# Altium project bs.PrjPcb (part 3 of 3)
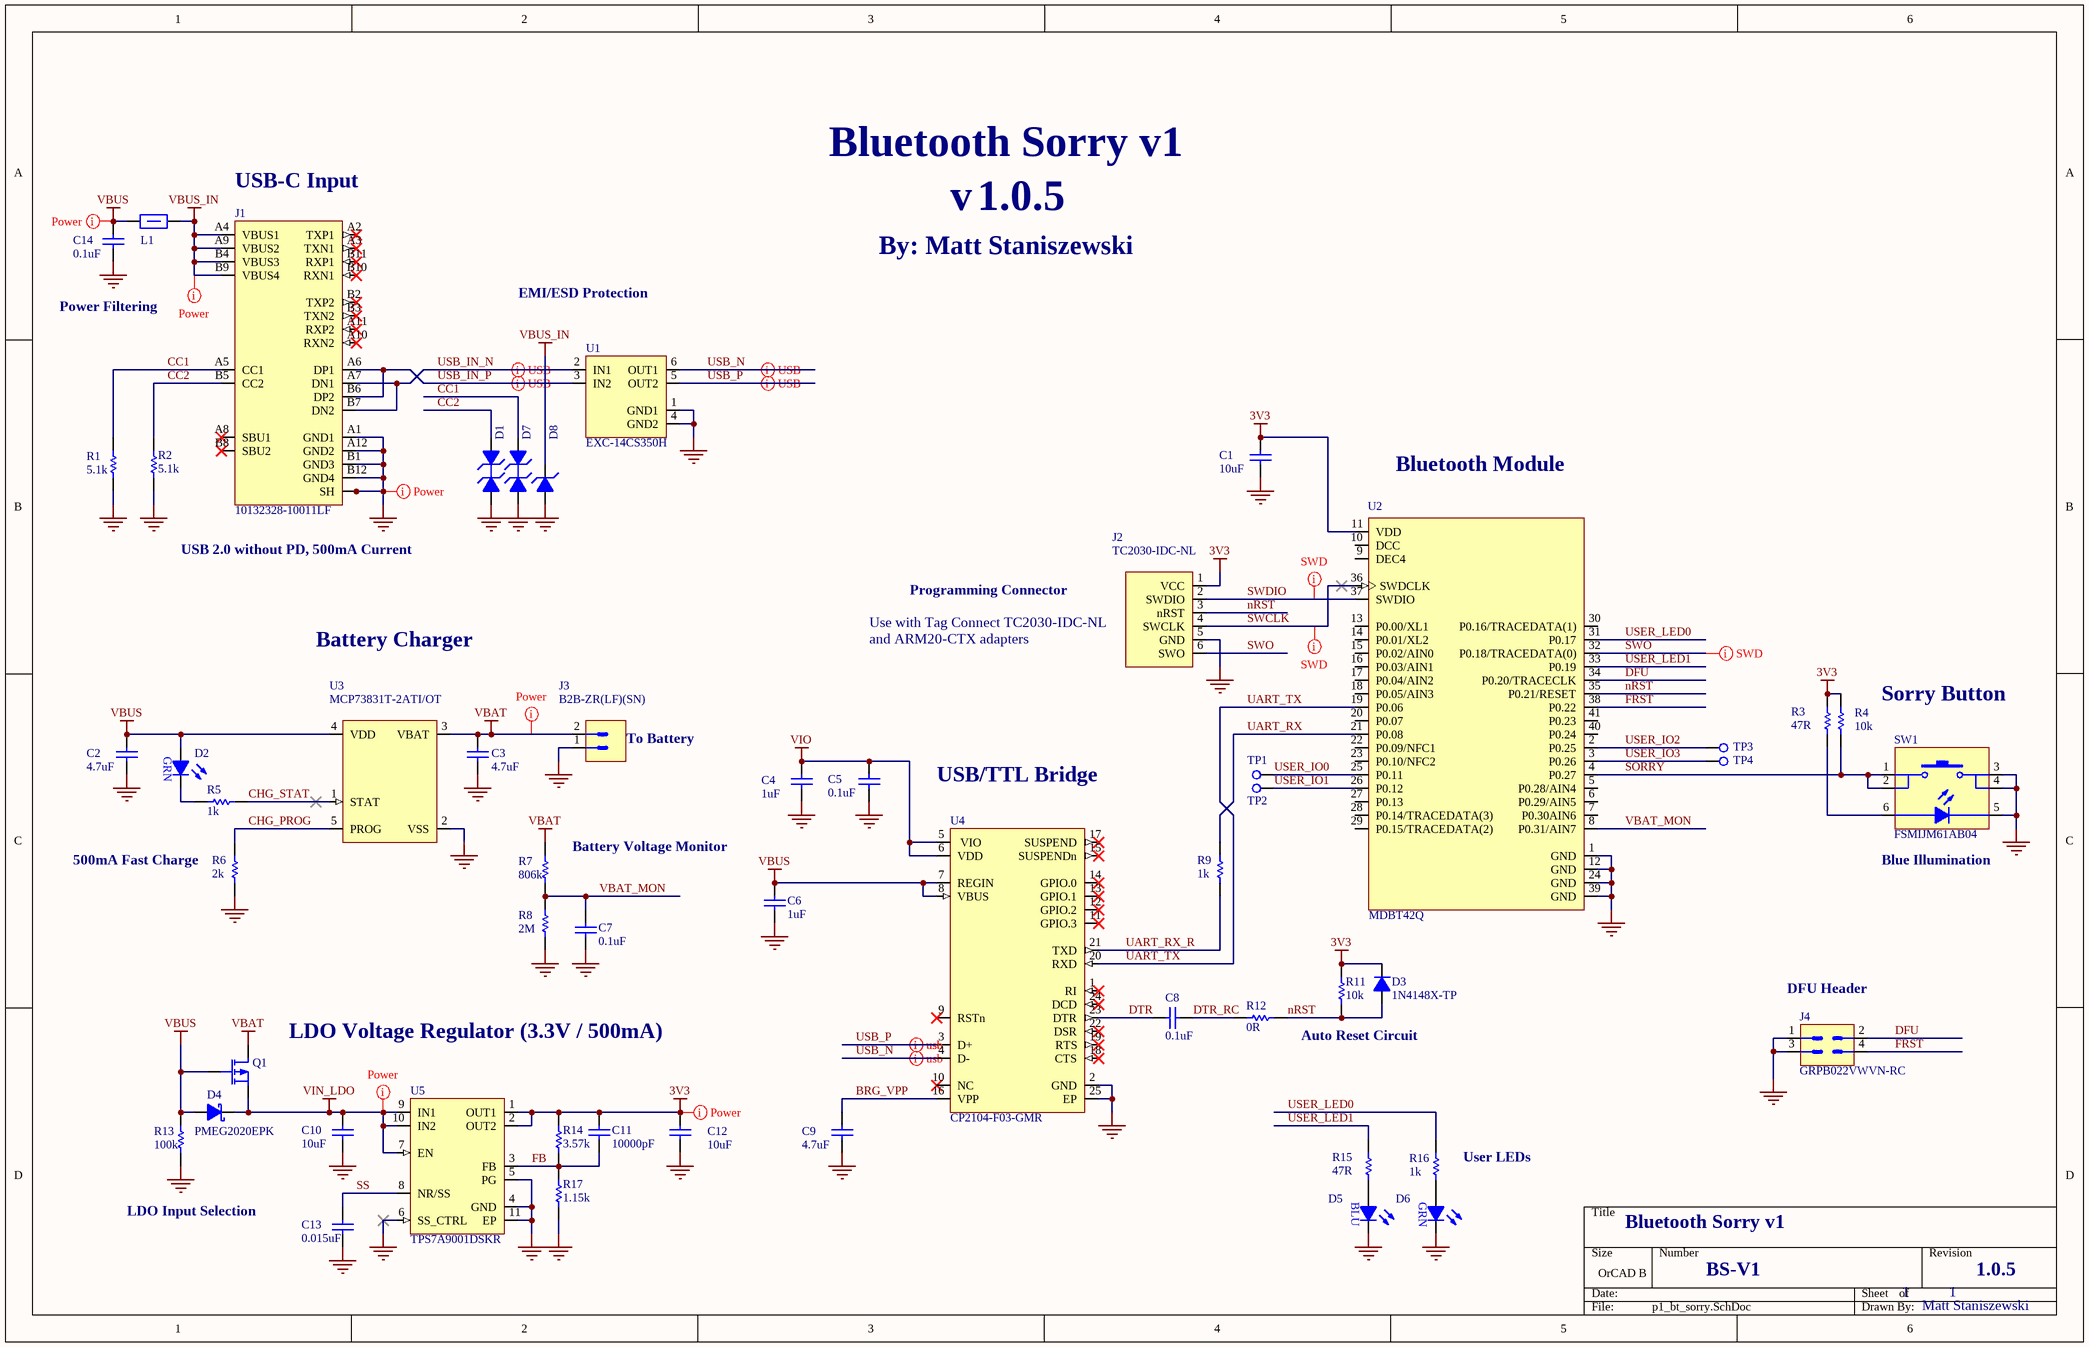
[diagram p2: p1_bt_sorry.SchDoc]

## Sheet p1_bt_sorry.SchDoc (continued)

### Library data of the parts (continued)
R13 = 100k 0402: RES SMD 100K OHM 1% 1/16W 0402; Manufacturer: Yageo; Manufacturer Part Number: RC0402FR-07100KL; Resistance: 100kR; Temperature Coefficient: 100ppm/°C; Power Rating: 63mW; Voltage Rating: 50V; Level: 1; Supplier 1: Digi-Key; Stock 1: 64634513; Pricing 1: 1 = 0.10000, 10 = 0.01600, 100 = 0.00670, 1000 = 0.00301, 2500 = 0.00261, 5000 = 0.00215 (USD); RoHS: Yes; Case/Package: 0402; Case Code (Metric): 1005; Case Code (Imperial): 0402; Min Operating Temperature: -55°C; Max Operating Temperature: 155°C; Composition: Thick Film; Tolerance: 1%; Packaging: Tape and Reel; Package Quantity: 1; Number of Terminations: 2; Termination: SMD/SMT; Military Standard: Not; Max Power Dissipation: 63mW; Working Voltage: 50V; Features: Moisture Resistant; Length: 0.039inch; Height: 0.016inch; Width: 0.02inch; Depth: 0.5mm; REACH SVHC: No SVHC; Lead Free: Lead Free; ComponentLink1URL: https://datasheet.ciiva.com/11819/0900766b80c66297-11819452.pdf?src-supplier=RSComponents; ComponentLink1Description: https://datasheet.ciiva.com/11819/0900766b80c66297-11819452.pdf?src-supplier=RSComponents; ComponentLink2URL: https://datasheet.ciiva.com/2453/pyu-r-int-thick-7-2453361.pdf?src-supplier=Digi-Key; ComponentLink2Description: https://datasheet.ciiva.com/2453/pyu-r-int-thick-7-2453361.pdf?src-supplier=Digi-Key; ComponentLink3URL: https://datasheet.ciiva.com/2453/pyu-r-int-thick-7-2453362.pdf?src-supplier=Digi-Key; ComponentLink3Description: https://datasheet.ciiva.com/2453/pyu-r-int-thick-7-2453362.pdf?src-supplier=Digi-Key; ComponentLink4URL: https://datasheet.ciiva.com/2453/pyu-r-int-thick-7-2453363.pdf?src-supplier=Digi-Key; ComponentLink4Description: https://datasheet.ciiva.com/2453/pyu-r-int-thick-7-2453363.pdf?src-supplier=Digi-Key; ComponentLink5URL: https://datasheet.ciiva.com/22747/1018594-22747509.pdf?src-supplier=Element14; ComponentLink5Description: https://datasheet.ciiva.com/22747/1018594-22747509.pdf?src-supplier=Element14; ComponentLink6URL: https://datasheet.ciiva.com/15189/getdatasheetpartid-323696-15189334.pdf?src-supplier=Verical; ComponentLink6Description: https://datasheet.ciiva.com/15189/getdatasheetpartid-323696-15189334.pdf?src-supplier=Verical; ComponentLink7URL: https://datasheet.ciiva.com/16740/pyu-rc0402-51-rohs-l-6-r-16740567.pdf?src-supplier=Future+Electronics; ComponentLink7Description: https://datasheet.ciiva.com/16740/pyu-rc0402-51-rohs-l-6-r-16740567.pdf?src-supplier=Future+Electronics; ComponentLink8URL: https://datasheet.ciiva.com/12667/pyu-rc0402-51-rohs-l-6-r-12667930.pdf?src-supplier=Mouser; ComponentLink8Description: https://datasheet.ciiva.com/12667/pyu-rc0402-51-rohs-l-6-r-12667930.pdf?src-supplier=Mouser; Supplier Part Number 1: 311-100KLRCT-ND; ClassName: SMT
R14 = 3.57k 0402: RES SMD 3.57K OHM 1% 1/10W 0402; Manufacturer: Panasonic; Manufacturer Part Number: ERJ-2RKF3571X; Voltage Rating: 50V; Resistance: 3.57kR; Power Rating: 100mW; Temperature Coefficient: 100ppm/°C; Level: 1; Supplier 1: Digi-Key; Stock 1: 676573; Pricing 1: 1=0.1, 10=0.043, 100=0.0176, 1000=0.00791, 2500=0.00686, 5000=0.00567 (USD); Mount: Surface Mount; Case/Package: 0402; Case Code (Metric): 1005; Case Code (Imperial): 0402; Contact Plating: Tin; Min Operating Temperature: -55°C; Max Operating Temperature: 155°C; Packaging: Tape and Reel; Tolerance: 1%; Package Quantity: 1; Composition: Thick Film; Number of Terminations: 2; Termination: SMD/SMT; Military Standard: Not; Max Power Dissipation: 100mW; Voltage Rating (DC): 50V; Length: 1mm; Height: 0.016inch; Width: 0.02inch; Depth: 0.5mm; REACH SVHC: No SVHC; Lead Free: Lead Free; ComponentLink1URL: https://datasheet.ciiva.com/24069/aoa0000ce2-24069909.pdf; ComponentLink1Description: https://datasheet.ciiva.com/24069/aoa0000ce2-24069909.pdf; ComponentLink2URL: https://datasheet.ciiva.com/28545/1694929-28545241.pdf; ComponentLink2Description: https://datasheet.ciiva.com/28545/1694929-28545241.pdf; ComponentLink3URL: https://datasheet.ciiva.com/7763/1678782-7763707.pdf; ComponentLink3Description: https://datasheet.ciiva.com/7763/1678782-7763707.pdf; ComponentLink4URL: https://datasheet.ciiva.com/30191/aoa0000ce2-30191243.pdf; ComponentLink4Description: https://datasheet.ciiva.com/30191/aoa0000ce2-30191243.pdf; ComponentLink5URL: https://datasheet.ciiva.com/16779/70260748-16779437.pdf; ComponentLink5Description: https://datasheet.ciiva.com/16779/70260748-16779437.pdf; ComponentLink6URL: https://datasheet.ciiva.com/22681/1678782-22681293.pdf; ComponentLink6Description: https://datasheet.ciiva.com/22681/1678782-22681293.pdf; Supplier Part Number 1: P3.57KLCT-ND; ClassName: SMT
R17 = 1.15k 0402: RES SMD 1.15K OHM 1% 1/10W 0402; Manufacturer: Panasonic; Manufacturer Part Number: ERJ-2RKF1151X; Resistance: 1.15kR; Power Rating: 100mW; Voltage Rating: 50V; Temperature Coefficient: 100ppm/°C; Level: 1; Supplier 1: Digi-Key; Stock 1: 99704; Pricing 1: 1=0.1, 10=0.043, 100=0.0176, 1000=0.00791, 2500=0.00686, 5000=0.00567 (USD); Mount: Surface Mount; Case/Package: 0402; Case Code (Imperial): 0402; Case Code (Metric): 1005; Contact Plating: Tin; Min Operating Temperature: -55°C; Max Operating Temperature: 155°C; Packaging: Tape and Reel; Tolerance: 1%; Package Quantity: 1; Termination: SMD/SMT; Composition: Thick Film; Number of Terminations: 2; Military Standard: Not; Max Power Dissipation: 100mW; Voltage Rating (DC): 50V; Length: 1mm; Height: 0.35mm; Width: 0.5mm; Depth: 0.5mm; Radiation Hardening: No; REACH SVHC: Yes; Lead Free: Lead Free; ComponentLink1URL: https://datasheet.ciiva.com/22721/1678782-22721221.pdf; ComponentLink1Description: https://datasheet.ciiva.com/22721/1678782-22721221.pdf; ComponentLink2URL: https://datasheet.ciiva.com/24027/aoa0000ce2-24027413.pdf; ComponentLink2Description: https://datasheet.ciiva.com/24027/aoa0000ce2-24027413.pdf; ComponentLink3URL: https://datasheet.ciiva.com/43467/1678782-43467317.pdf; ComponentLink3Description: https://datasheet.ciiva.com/43467/1678782-43467317.pdf; ComponentLink4URL: https://datasheet.ciiva.com/46373/1678782-46373832.pdf; ComponentLink4Description: https://datasheet.ciiva.com/46373/1678782-46373832.pdf; ComponentLink5URL: https://datasheet.ciiva.com/46373/1678782-46373833.pdf; ComponentLink5Description: https://datasheet.ciiva.com/46373/1678782-46373833.pdf; ComponentLink6URL: https://datasheet.ciiva.com/16768/70260748-16768765.pdf; ComponentLink6Description: https://datasheet.ciiva.com/16768/70260748-16768765.pdf; Supplier Part Number 1: P1.15KLCT-ND; ClassName: SMT
SW1 = Pushbutton Switch, Blue Illuminated: SWITCH TACTILE SPST-NO 50MA 12V; Manufacturer: TE Connectivity Alcoswitch; Operating Force: 100gf; Level: 1; Supplier 1: Digikey; Manufacturer Part Number: FSMIJM61AB04; Stock 1: 1218; Pricing 1: 1 = 3.90000, 10 = 3.74600, 25 = 3.44600, 50 = 2.99660, 100 = 2.84680 (USD); RoHS: No; Mount: Surface Mount; Contact Material: Brass; Contact Plating: Silver; Illumination Type: Illuminated; Contact Current Rating: 50mA; REACH SVHC: No SVHC; ComponentLink1URL: http://www.farnell.com/datasheets/2074198.pdf?src-supplier=Element14; ComponentLink1Description: http://www.farnell.com/datasheets/2074198.pdf?src-supplier=Element14; Supplier Part Number 1: 450-2207-1-ND; ClassName: SMT
TP1-TP4 = TP SMT 0.5MM: 0.5mm SMT Test Point; Level: 1; ClassName: Testpoints
U1 = EXC-14CS350H: CMC 100MA 2LN 35 OHM SMD ESD; Manufacturer: Panasonic; Level: 1; Supplier 1: Digi-Key; Manufacturer Part Number: EXC-14CS350H; Stock 1: 12872; Pricing 1: 1 = 0.22000, 10 = 0.20200, 100 = 0.13490, 500 = 0.11242, 1000 = 0.09444, 2500 = 0.08095 (USD); RoHS: No; Supplier Part Number 1: P19421CT-ND; ClassName: SMT,Sensitive Exception
U2 = MDBT42Q: MDBT42Q NRF52832 BASED BLE MODUL; Manufacturer: Seeed Studio; Manufacturer Part Number: 317030213; Level: 1; Supplier 1: Digi-Key; Stock 1: 333; Pricing 1: 1 = 10.10000 (USD); RoHS: No; ComponentLink1URL: http://statics3.seeedstudio.com/assets/file/bazaar/product/MDBT42Q-Version_B.pdf?src-supplier=Digi-Key; ComponentLink1Description: http://statics3.seeedstudio.com/assets/file/bazaar/product/MDBT42Q-Version_B.pdf?src-supplier=Digi-Key; Supplier Part Number 1: 1597-1434-ND; ClassName: SMT,Sensitive Exception
U3 = MCP73831T-2ATI/OT: IC CONTROLLR LI-ION 4.2V SOT23-5; Manufacturer: Microchip; Output Current: 500mA; Min Supply Voltage: 3.75V; Max Supply Voltage: 6V; Number of Cells: 1; Max Output Voltage: 4.232V; Min Output Voltage: 4.168V; Supplier 1: Digi-Key; Manufacturer Part Number: MCP73831T-2ATI/OT; Stock 1: 22234; Pricing 1: 1 = 0.58000, 25 = 0.48400, 100 = 0.43260 (USD); RoHS: Yes; Mount: Surface Mount; Case/Package: SOT-23; Number of Pins: 5; Min Operating Temperature: -40°C; Max Operating Temperature: 85°C; Output Voltage: 4.2V; Packaging: Tape and Reel; Package Quantity: 3000; Max Output Current: 500mA; Max Charge Current: 500mA; Length: 3.1mm; Height: 1.3mm; Width: 1.8mm; REACH SVHC: No SVHC; Lead Free: Lead Free; ComponentLink1URL: https://datasheet.ciiva.com/26344/651522-da-01-en-contr-mcp73831t-2ati-ot-sot-23-5-mcp-26344457.pdf?src-supplier=Conrad; ComponentLink1Description: https://datasheet.ciiva.com/26344/651522-da-01-en-contr-mcp73831t-2ati-ot-sot-23-5-mcp-26344457.pdf?src-supplier=Conrad; ComponentLink2URL: https://datasheet.ciiva.com/1931/21984e-1931956.pdf?src-supplier=Digi-Key; ComponentLink2Description: https://datasheet.ciiva.com/1931/21984e-1931956.pdf?src-supplier=Digi-Key; ComponentLink3URL: https://datasheet.ciiva.com/1931/21984e-1931957.pdf?src-supplier=Digi-Key; ComponentLink3Description: https://datasheet.ciiva.com/1931/21984e-1931957.pdf?src-supplier=Digi-Key; ComponentLink4URL: https://datasheet.ciiva.com/1931/21984e-1931958.pdf?src-supplier=Digi-Key; ComponentLink4Description: https://datasheet.ciiva.com/1931/21984e-1931958.pdf?src-supplier=Digi-Key; ComponentLink5URL: https://datasheet.ciiva.com/17299/21984e-17299304.pdf?src-supplier=Avnet+Europe; ComponentLink5Description: https://datasheet.ciiva.com/17299/21984e-17299304.pdf?src-supplier=Avnet+Europe; ComponentLink6URL: https://datasheet.ciiva.com/1137/630369-1137804.pdf?src-supplier=Element14; ComponentLink6Description: https://datasheet.ciiva.com/1137/630369-1137804.pdf?src-supplier=Element14; ComponentLink7URL: https://datasheet.ciiva.com/8039/630369-8039388.pdf?src-supplier=Element14; ComponentLink7Description: https://datasheet.ciiva.com/8039/630369-8039388.pdf?src-supplier=Element14; ComponentLink8URL: https://datasheet.ciiva.com/16217/filehandler-aspxddocname-en025112-16217052.pdf?src-supplier=Future+Electronics; ComponentLink8Description: https://datasheet.ciiva.com/16217/filehandler-aspxddocname-en025112-16217052.pdf?src-supplier=Future+Electronics; ComponentLink9URL: https://datasheet.ciiva.com/3213/21984e-3213405.pdf?src-supplier=Avnet; ComponentLink9Description: https://datasheet.ciiva.com/3213/21984e-3213405.pdf?src-supplier=Avnet; Supplier Part Number 1: MCP73831T-2ATI/OTCT-ND; ClassName: SMT; Level: 1
U4 = CP2104-F03-GMR: IC SGL USB-TO-UART BRIDGE 24QFN; Manufacturer: Silicon Labs; Number of Channels: 1; Max Supply Voltage: 3.6V; Min Supply Voltage: 3V; Operating Supply Voltage: 3.3V; Data Rate: 2Mbps; Number of I/Os: 4; Interface: UART; Operating Supply Current: 17mA; Supplier 1: Digi-Key; Manufacturer Part Number: CP2104-F03-GMR; Stock 1: 20484; Pricing 1: 1 = 1.65000, 25 = 1.58640, 100 = 1.58360 (USD); RoHS: Yes; Mount: Surface Mount; Case/Package: QFN EP; Number of Pins: 24; Weight: 0.001764oz; Contact Plating: Tin; Min Operating Temperature: -40°C; Max Operating Temperature: 85°C; Packaging: Tape and Reel; Package Quantity: 1500; Radiation Hardening: No; ComponentLink1URL: https://datasheet.ciiva.com/14939/cp2104-14939979.pdf?src-supplier=Digi-Key; ComponentLink1Description: https://datasheet.ciiva.com/14939/cp2104-14939979.pdf?src-supplier=Digi-Key; ComponentLink2URL: https://datasheet.ciiva.com/16639/cp2104-16639756.pdf?src-supplier=Avnet+Europe; ComponentLink2Description: https://datasheet.ciiva.com/16639/cp2104-16639756.pdf?src-supplier=Avnet+Europe; ComponentLink3URL: https://datasheet.ciiva.com/15150/getdatasheetpartid-711722-15150533.pdf?src-supplier=Verical; ComponentLink3Description: https://datasheet.ciiva.com/15150/getdatasheetpartid-711722-15150533.pdf?src-supplier=Verical; Supplier Part Number 1: 336-4146-1-ND; ClassName: SMT,Sensitive Exception; Level: 1
U5 = TPS7A9001DSKR: ULTRA LOW NOISE 0.5A LDO WITH P; Manufacturer: Texas Instruments; Level: 1; Supplier 1: Digi-Key; Manufacturer Part Number: TPS7A9001DSKR; Stock 1: 105; Pricing 1: 1=1.6, 10=1.441, 100=1.1584, 500=0.95172, 1000=0.78857 (USD); Min Operating Temperature: -40°C; Max Operating Temperature: 125°C; Supplier Part Number 1: 296-48316-1-ND; ClassName: SMT

## Assembly variants
Default: all parts fitted